# Altium project Kanaloa_v2.0.0_Power.PrjPcb
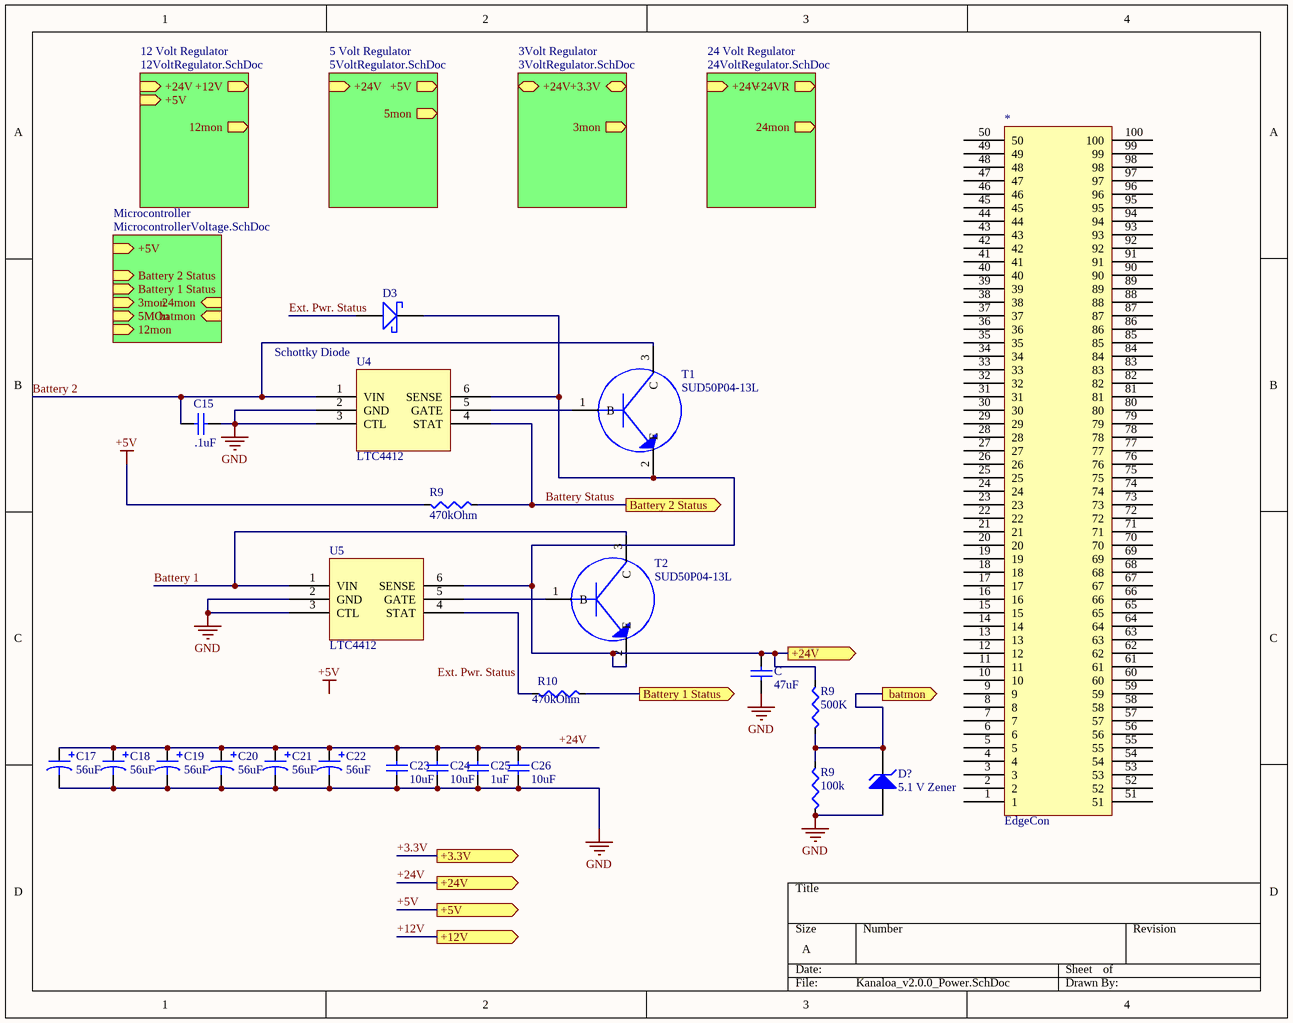
[diagram p0: Kanaloa_v2.0.0_Power.SchDoc]
6 sheets, 97 parts. Net scope: hierarchical (ports join the sheet entries above them; power ports are global).
Board file: Kanaloa_v2.0.0_Power.PcbDoc
Sheets:
  Kanaloa_v2.0.0_Power.SchDoc
    Microcontroller = MicrocontrollerVoltage.SchDoc
    5 Volt Regulator = 5VoltRegulator.SchDoc
    3Volt Regulator = 3VoltRegulator.SchDoc
    12 Volt Regulator = 12VoltRegulator.SchDoc
    24 Volt Regulator = 24VoltRegulator.SchDoc

## Sheet Kanaloa_v2.0.0_Power.SchDoc
size A

### Parts
(Parts that share a designator on the sheet are numbered #1, #2 ... from top to bottom, then left to right.)
*  EdgeCon  [5645235-3 CON]
C  47uF  [1210 (3225) Capacitor]
C15  .1uF  [0805 (2012) Capacitor]
C17  56uF  [Radial_8mmDia_SM_E]
C18  56uF  [Radial_8mmDia_SM_E]
C19  56uF  [Radial_8mmDia_SM_E]
C20  56uF  [Radial_8mmDia_SM_E]
C21  56uF  [Radial_8mmDia_SM_E]
C22  56uF  [Radial_8mmDia_SM_E]
C23  10uF  [0805 (2012) Capacitor]
C24  10uF  [0805 (2012) Capacitor]
C25  1uF  [0805 (2012) Capacitor]
C26  10uF  [0805 (2012) Capacitor]
D3  Schottky Diode  [DO-41]
D?#1  5.1 V Zener  [DIODE-0.7]
R9#1  470kOhm  [R 0805 (2012) RESISTOR]
R9#2  500K  [R 0805 (2012) RESISTOR]
R9#3  100k  [R 0805 (2012) RESISTOR]
R10  470kOhm  [R 0805 (2012) RESISTOR]
T1  SUD50P04-13L  [SOT23]
T2  SUD50P04-13L  [SOT23]
U4  LTC4412  [SOT95P245X110-6N]
U5#1  LTC4412  [SOT95P245X110-6N]

### Sub-sheets
3Volt Regulator = 3VoltRegulator.SchDoc: +24V, +3.3V, 3mon (out)
5 Volt Regulator = 5VoltRegulator.SchDoc: +24V (in), +5V (out), 5mon (out)
12 Volt Regulator = 12VoltRegulator.SchDoc: +24V (in), +12V (out), +5V (in), 12mon (out)
24 Volt Regulator = 24VoltRegulator.SchDoc: +24V (in), +24VR (out), 24mon (out)
Microcontroller = MicrocontrollerVoltage.SchDoc: +5V (in), Battery 2 Status (in), Battery 1 Status (in), 3mon (in), 5MOn (in), 12mon (in), 24mon (in), batmon (in)

### Ports
+3.3V (out), +5V (out), +12V (out), +24V (out), batmon (out), Battery 1 Status (out), Battery 2 Status (out)

### Nets
+5V: R9#1.2 ; port +5V, sheet Microcontroller/+5V
GND: C.1 C15.2 C17.N C18.N C19.N C20.N C21.N C22.N C23.2 C24.2 C25.2 C26.2 D?#1.1(A) R9#3.1 U4.2(GND) U4.3(CTL) U5#1.2(GND) U5#1.3(CTL)
+3.3V: port +3.3V
+12V: port +12V
+24V: C.2 C17.P C18.P C19.P C20.P C21.P C22.P C23.1 C24.1 C25.1 C26.1 D3.K R9#2.2 T1.2(E) T2.2(E) U4.6(SENSE) U5#1.6(SENSE) ; port +24V
Battery 1: T2.3(C) U5#1.1(VIN)
Battery 2: C15.1 T1.3(C) U4.1(VIN)
Battery Status: R9#1.1 U4.4(STAT) ; port Battery 2 Status
Ext. Pwr. Status: D3.A
NetBIG$$1_9: sheet 5 Volt Regulator/+5V, sheet 5 Volt Regulator/5mon
NetBIG$$3_9: sheet 3Volt Regulator/+3.3V, sheet 3Volt Regulator/3mon
NetD?#1_2: D?#1.2(K) R9#2.1 R9#3.2 ; port batmon
NetR10_1: R10.1 ; port Battery 1 Status
NetR10_2: R10.2 U5#1.4(STAT)
NetT1_1: T1.1(B) U4.5(GATE)
NetT2_1: T2.1(B) U5#1.5(GATE)

Not connected (* = marked no-connect by the designer): * 1 2 3 4 5 6 7 8 9 10 11 12 13 14 15 16 17 18 19 20 21 22 23 24 25 26 27 28 29 30 31 32 33 34 35 36 37 38 39 40 41 42 43 44 45 46 47 48 49 50 51 52 53 54 55 56 57 58 59 60 61 62 63 64 65 66 67 68 69 70 71 72 73 74 75 76 77 78 79 80 81 82 83 84 85 86 87 88 89 90 91 92 93 94 95 96 97 98 99 100

### Notes on the sheet
- Labels drawn without touching a wire or pin: +5V, Ext. Pwr. Status

### Library data of the parts
C C23-C26 = Capacitor (non-polarized): Capacitor; Value: .1uF
C15 = Capacitor (non-polarized): Capacitor; Value: .1uF
C17-C22 = Capacitor (polarized)
D?#1 = D Zener: Zener Diode; Published: 8-Jun-2000; LatestRevisionDate: 17-Jul-2002; LatestRevisionNote: Re-released for DXP Platform.; PackageReference: DIODE-0.7; Publisher: Altium Limited; PackageDescription: Diode, Thru-Hole; 2 Leads; 0.7 in Pin Spacing
R9#1-R9#3 R10 = Resistor: Value: 0Ohm
T1 T2 = Transistor
U4 U5#1 = LTC4412: Low Loss Power Path Controller in Thin SOT

## Sheet MicrocontrollerVoltage.SchDoc
size A
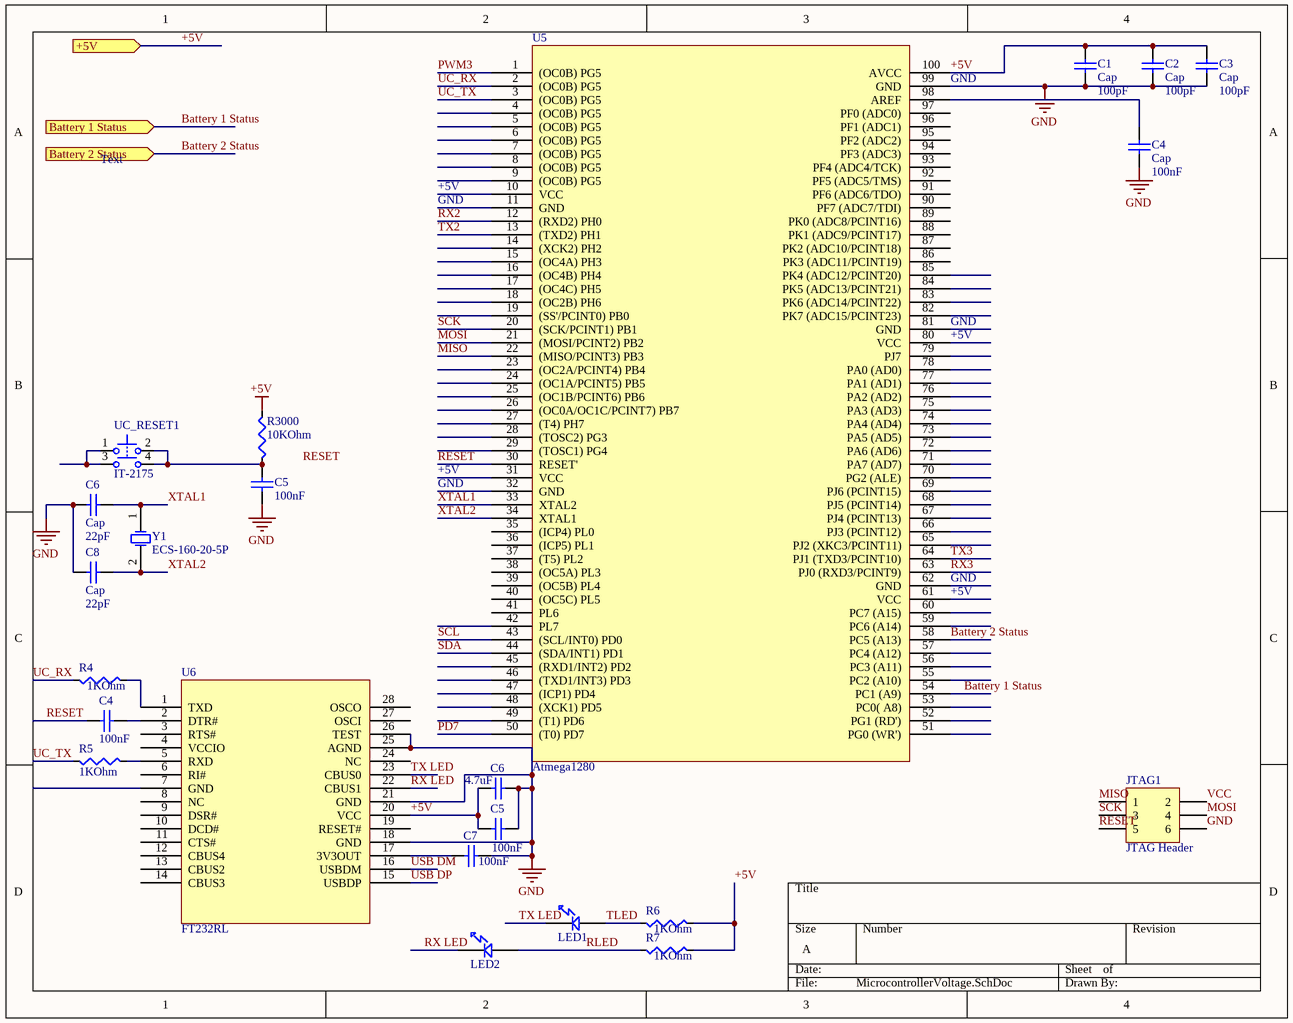
[diagram p1: MicrocontrollerVoltage.SchDoc]

### Parts
(Parts that share a designator on the sheet are numbered #1, #2 ... from top to bottom, then left to right.)
C1  Cap  value 100pF  [0805 (2012) Capacitor]
C2  Cap  value 100pF  [0805 (2012) Capacitor]
C3  Cap  value 100pF  [0805 (2012) Capacitor]
C4#1  Cap  value 100nF  [0805 (2012) Capacitor]
C4#2  100nF  [0805 (2012) Capacitor]
C5#1  100nF  [0805 (2012) Capacitor]
C5#2  100nF  [0805 (2012) Capacitor]
C6#1  Cap  value 22pF  [0805 (2012) Capacitor]
C6#2  4.7uF  [0805 (2012) Capacitor]
C7  100nF  [0805 (2012) Capacitor]
C8  Cap  value 22pF  [0805 (2012) Capacitor]
JTAG1  JTAG Header  [HDR2X3]
LED1  LED  [LED 0805]  (value not drawn)
LED2  LED  [LED 0805]  (value not drawn)
R4  1KOhm  [R 0805 (2012) RESISTOR]
R5  1KOhm  [R 0805 (2012) RESISTOR]
R6  1KOhm  [R 0805 (2012) RESISTOR]
R7  1KOhm  [R 0805 (2012) RESISTOR]
R3000  10KOhm  [R 0805 (2012) RESISTOR]
U5#2  Atmega1280  [TSQFP50P1600X1600X120-100N]
U6  FT232RL  [SOP65P780X200-28N]
UC_RESET1  IT-2175  [IT-2175]
Y1  ECS-160-20-5P  [CSM-7]

### Ports
+5V (in), Battery 1 Status (in), Battery 2 Status (in)

### Nets
+5V: C1.2 C2.2 C3.2 C5#2.1 C6#2.1 R6.2 R7.2 R3000.1 U5#2.10(VCC) U5#2.31(VCC) U5#2.61(VCC) U5#2.80(VCC) U5#2.100(AVCC) U6.20(VCC) ; port +5V
GND: C1.1 C2.1 C3.1 C4#1.1 C5#1.1 C5#2.2 C6#1.1 C6#2.2 C7.2 C8.1 JTAG1.6 U5#2.11(GND) U5#2.32(GND) U5#2.62(GND) U5#2.81(GND) U5#2.99(GND) U6.18(GND) U6.21(GND) U6.25(AGND) U6.26(TEST)
Battery 1 Status: U5#2.54(PC1_(A9)) ; port Battery 1 Status
Battery 2 Status: U5#2.58(PC5_(A13)) ; port Battery 2 Status
MISO: JTAG1.1 U5#2.22((MISO/PCINT3)_PB3)
MOSI: JTAG1.4 U5#2.21((MOSI/PCINT2)_PB2)
PD7: U5#2.50((T0)_PD7)
PWM3: U5#2.1((OC0B)_PG5)
RESET: C4#2.1 JTAG1.5 U5#2.30(RESET')
RLED: LED2.2 R7.1
RX2: U5#2.12((RXD2)_PH0)
RX3: U5#2.63(PJ0_(RXD3/PCINT9))
RX LED: LED2.1 U6.22(CBUS1)
SCK: JTAG1.3 U5#2.20((SCK/PCINT1)_PB1)
SCL: U5#2.43((SCL/INT0)_PD0)
SDA: U5#2.44((SDA/INT1)_PD1)
TLED: LED1.2 R6.1
TX2: U5#2.13((TXD2)_PH1)
TX3: U5#2.64(PJ1_(TXD3/PCINT10))
TX LED: LED1.1 U6.23(CBUS0)
UC_RX: R4.1 U5#2.2((OC0B)_PG5)
UC_TX: R5.1 U5#2.3((OC0B)_PG5)
USB DM: U6.16(USBDM)
USB DP: U6.15(USBDP)
VCC: JTAG1.2
XTAL1: C6#1.2 U5#2.33(XTAL2) Y1.1(OSC1)
XTAL2: C8.2 U5#2.34(XTAL1) Y1.2(OSC2)
NetC4#1_2: C4#1.2 U5#2.98(AREF)
NetC4#2_2: C4#2.2 U6.2(DTR#)
NetC5#1_2: C5#1.2 R3000.2 UC_RESET1.2 UC_RESET1.4
NetC7_1: C7.1 U6.17(3V3OUT)
NetR4_2: R4.2 U6.1(TXD)
NetR5_2: R5.2 U6.5(RXD)
NetUC_RESET1_1: UC_RESET1.1 UC_RESET1.3

Not connected (* = marked no-connect by the designer): U5#2 4((OC0B)_PG5) 5((OC0B)_PG5) 6((OC0B)_PG5) 7((OC0B)_PG5) 8((OC0B)_PG5) 9((OC0B)_PG5) 14((XCK2)_PH2) 15((OC4A)_PH3) 16((OC4B)_PH4) 17((OC4C)_PH5) 18((OC2B)_PH6) 19((SS'/PCINT0)_PB0) 23((OC2A/PCINT4)_PB4) 24((OC1A/PCINT5)_PB5) 25((OC1B/PCINT6)_PB6) 26((OC0A/OC1C/PCINT7)_PB7) 27((T4)_PH7) 28((TOSC2)_PG3) 29((TOSC1)_PG4) 35((ICP4)_PL0) 36((ICP5)_PL1) 37((T5)_PL2) 38((OC5A)_PL3) 39((OC5B)_PL4) 40((OC5C)_PL5) 41(PL6) 42(PL7) 45((RXD1/INT2)_PD2) 46((TXD1/INT3)_PD3) 47((ICP1)_PD4) 48((XCK1)_PD5) 49((T1)_PD6) 51(PG0_(WR')) 52(PG1_(RD')) 53(PC0(_A8)) 55(PC2_(A10)) 56(PC3_(A11)) 57(PC4_(A12)) 59(PC6_(A14)) 60(PC7_(A15)) 65(PJ2_(XKC3/PCINT11)) 66(PJ3_(PCINT12)) 67(PJ4_(PCINT13)) 68(PJ5_(PCINT14)) 69(PJ6_(PCINT15)) 70(PG2_(ALE)) 71(PA7_(AD7)) 72(PA6_(AD6)) 73(PA5_(AD5)) 74(PA4_(AD4)) 75(PA3_(AD3)) 76(PA2_(AD2)) 77(PA1_(AD1)) 78(PA0_(AD0)) 79(PJ7) 82(PK7_(ADC15/PCINT23)) 83(PK6_(ADC14/PCINT22)) 84(PK5_(ADC13/PCINT21)) 85(PK4_(ADC12/PCINT20)) 86(PK3_(ADC11/PCINT19)) 87(PK2_(ADC10/PCINT18)) 88(PK1_(ADC9/PCINT17)) 89(PK0_(ADC8/PCINT16)) 90(PF7_(ADC7/TDI)) 91(PF6_(ADC6/TDO)) 92(PF5_(ADC5/TMS)) 93(PF4_(ADC4/TCK)) 94(PF3_(ADC3)) 95(PF2_(ADC2)) 96(PF1_(ADC1)) 97(PF0_(ADC0)); U6 3(RTS#) 4(VCCIO) 6(RI#) 7(GND) 8(NC) 9(DSR#) 10(DCD#) 11(CTS#) 12(CBUS4) 13(CBUS2) 14(CBUS3) 19(RESET#) 24(NC) 27(OSCI) 28(OSCO)

### Notes on the sheet
- Text
- Labels drawn without touching a wire or pin: RESET

### Library data of the parts
C1-C3 C4#1 C6#1 C8 = Cap: Capacitor; Published: 8-Jun-2000; LatestRevisionDate: 17-Jul-2002; LatestRevisionNote: Re-released for DXP Platform.; PackageReference: RAD-0.3; Publisher: Altium Limited
C4#2 C5#1 C5#2 C6#2 C7 = Capacitor (non-polarized): Capacitor; Value: .1uF
JTAG1 = Header 3X2: Header, 3-Pin, Dual row; LatestRevisionDate: 17-Jul-2002; LatestRevisionNote: Re-released for DXP Platform.; Publisher: Altium Limited
LED1 LED2 = LED: Standard LED
R4-R7 R3000 = Resistor: Value: 0Ohm
UC_RESET1 = IT-2175: Tactile Switch, DPST; Thru-Hole; Vertical; Rating DC 12V, 50mA (max); PackageDocument: Rev.0; Published: 6-Jun-2005; DatasheetDocument: Rev.0; PackageReference: IT-2175; Publisher: Altium Limited; ComponentLink1Description: Manufacturer Link; ComponentLink1URL: http://www.ilswitch.com/; ComponentLink2Description: Device Overview; ComponentLink2URL: http://www.ilswitch.com/list.php?ac_id=010112&ai_id=91
Y1 = ECS-120-32-1: Crystal Oscillator; Published: 17-Jul-2002; DatasheetDocument: 18-Apr-2000; PackageReference: HC-49U; Publisher: Altium Limited; ComponentLink1Description: Manufacturer Link; ComponentLink1URL: http://www.ecsxtal.com/; ComponentLink2Description: Datasheet; ComponentLink2URL: http://www.ecsxtal.com/pdf2/HC49U.PDF

## Sheet 5VoltRegulator.SchDoc
size A
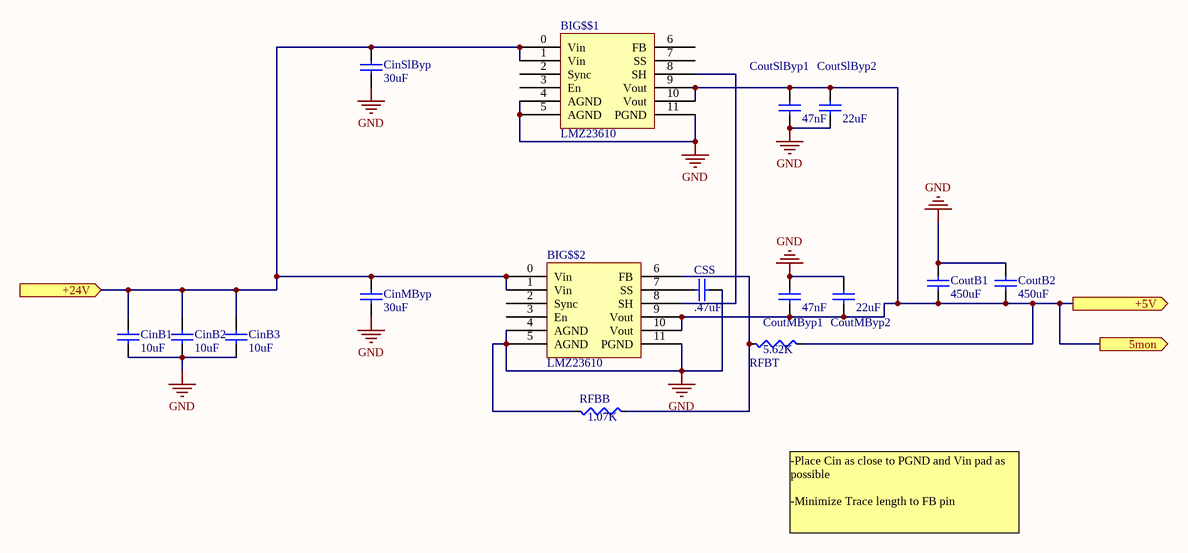
[diagram p2: 5VoltRegulator.SchDoc]

### Parts
(Parts that share a designator on the sheet are numbered #1, #2 ... from top to bottom, then left to right.)
BIG$$1  LMZ23610  [LMZ23610]
BIG$$2  LMZ23610  [LMZ23610]
CinB1  10uF  [0805 (2012) Capacitor]
CinB2  10uF  [0805 (2012) Capacitor]
CinB3  10uF  [0805 (2012) Capacitor]
CinMByp  30uF  [0805 (2012) Capacitor]
CinSlByp  30uF  [0805 (2012) Capacitor]
CoutB1  450uF  [0805 (2012) Capacitor]
CoutB2  450uF  [0805 (2012) Capacitor]
CoutMByp1  47nF  [0805 (2012) Capacitor]
CoutMByp2  22uF  [0805 (2012) Capacitor]
CoutSlByp1  47nF  [0805 (2012) Capacitor]
CoutSlByp2  22uF  [0805 (2012) Capacitor]
CSS#1  .47uF  [0805 (2012) Capacitor]
RFBB#1  1.07K  [R 0805 (2012) RESISTOR]
RFBT#1  5.62K  [R 0805 (2012) RESISTOR]

### Ports
5mon (out), +5V (out), +24V (in)

### Nets
GND: BIG$$1.4(AGND) BIG$$1.5(AGND) BIG$$1.11(PGND) BIG$$2.4(AGND) BIG$$2.5(AGND) BIG$$2.11(PGND) CinB1.1 CinB2.1 CinB3.1 CinMByp.1 CinSlByp.1 CoutB1.2 CoutB2.2 CoutMByp1.2 CoutMByp2.2 CoutSlByp1.1 CoutSlByp2.1 CSS#1.2 RFBB#1.1
NetBIG$$1_0: BIG$$1.0(Vin) BIG$$1.1(Vin) BIG$$2.0(Vin) BIG$$2.1(Vin) CinB1.2 CinB2.2 CinB3.2 CinMByp.2 CinSlByp.2 ; port +24V
NetBIG$$1_8: BIG$$1.8(SH) BIG$$2.8(SH)
NetBIG$$1_9: BIG$$1.9(Vout) BIG$$1.10(Vout) BIG$$2.9(Vout) BIG$$2.10(Vout) CoutB1.1 CoutB2.1 CoutMByp1.1 CoutMByp2.1 CoutSlByp1.2 CoutSlByp2.2 RFBT#1.2 ; port +5V, port 5mon
NetBIG$$2_6: BIG$$2.6(FB) RFBB#1.2 RFBT#1.1
NetBIG$$2_7: BIG$$2.7(SS) CSS#1.1

Not connected (* = marked no-connect by the designer): BIG$$1 2(Sync) 3(En) 6(FB) 7(SS); BIG$$2 2(Sync) 3(En)

### Notes on the sheet
- -Place Cin as close to PGND and Vin pad as possible
  -Minimize Trace length to FB pin

### Library data of the parts
CinB1-CinB3 CinMByp CinSlByp CoutB1 CoutB2 CoutMByp1 CoutMByp2 CoutSlByp1 CoutSlByp2 CSS#1 = Capacitor (non-polarized): Capacitor; Value: .1uF
RFBB#1 RFBT#1 = Resistor: Value: 0Ohm

## Sheet 3VoltRegulator.SchDoc
size A
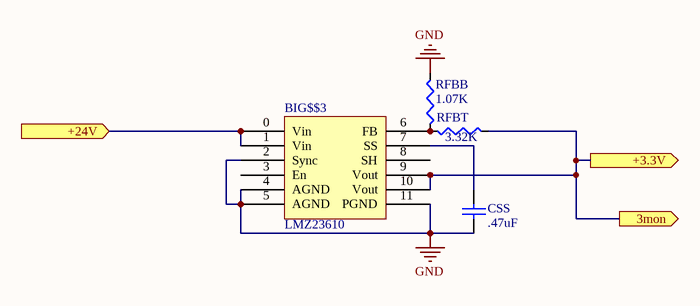
[diagram p3: 3VoltRegulator.SchDoc]

### Parts
(Parts that share a designator on the sheet are numbered #1, #2 ... from top to bottom, then left to right.)
BIG$$3  LMZ23610  [LMZ23610]
CSS#2  .47uF  [0805 (2012) Capacitor]
RFBB#2  1.07K  [R 0805 (2012) RESISTOR]
RFBT#2  3.32K  [R 0805 (2012) RESISTOR]

### Ports
3mon (out), +3.3V (out), +24V (in)

### Nets
GND: BIG$$3.2(Sync) BIG$$3.4(AGND) BIG$$3.5(AGND) BIG$$3.11(PGND) CSS#2.1 RFBB#2.2
NetBIG$$3_0: BIG$$3.0(Vin) BIG$$3.1(Vin) ; port +24V
NetBIG$$3_6: BIG$$3.6(FB) RFBB#2.1 RFBT#2.1
NetBIG$$3_7: BIG$$3.7(SS) CSS#2.2
NetBIG$$3_9: BIG$$3.9(Vout) BIG$$3.10(Vout) RFBT#2.2 ; port +3.3V, port 3mon

Not connected (* = marked no-connect by the designer): BIG$$3 3(En) 8(SH)

### Library data of the parts
CSS#2 = Capacitor (non-polarized): Capacitor; Value: .1uF
RFBB#2 RFBT#2 = Resistor: Value: 0Ohm

## Sheet 12VoltRegulator.SchDoc
size A
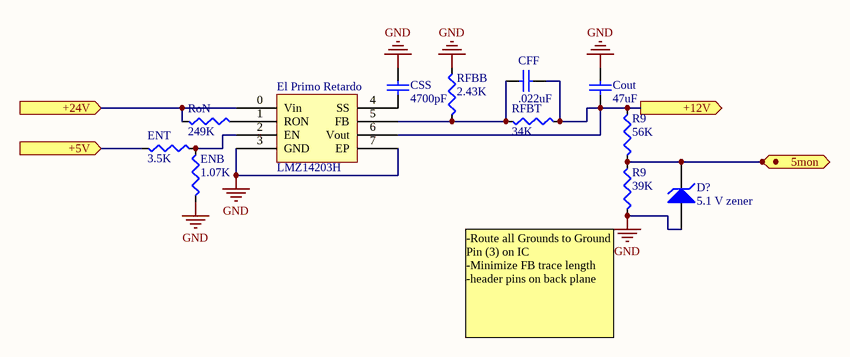
[diagram p4: 12VoltRegulator.SchDoc]

### Parts
(Parts that share a designator on the sheet are numbered #1, #2 ... from top to bottom, then left to right.)
CFF#1  .022uF  [0805 (2012) Capacitor]
Cout  47uF  [0805 (2012) Capacitor]
CSS#3  4700pF  [0805 (2012) Capacitor]
D?#2  5.1 V zener  [DIODE-0.7]
El_Primo_Retardo  LMZ14203H  [LMZ14203H]
ENB  1.07K  [R 0805 (2012) RESISTOR]
ENT  3.5K  [R 0805 (2012) RESISTOR]
R9#4  56K  [R 0805 (2012) RESISTOR]
R9#5  39K  [R 0805 (2012) RESISTOR]
RFBB#3  2.43K  [R 0805 (2012) RESISTOR]
RFBT#3  34K  [R 0805 (2012) RESISTOR]
RoN  249K  [R 0805 (2012) RESISTOR]

### Ports
5mon (out), +5V (in), +12V (out), +24V (in)

### Nets
GND: Cout.2 CSS#3.2 D?#2.1(A) El_Primo_Retardo.3(GND) El_Primo_Retardo.7(EP) ENB.1 R9#5.1 RFBB#3.2
NetCFF#1_1: CFF#1.1 Cout.1 El_Primo_Retardo.6(Vout) R9#4.1 RFBT#3.1 ; port +12V
NetCFF#1_2: CFF#1.2 El_Primo_Retardo.5(FB) RFBB#3.1 RFBT#3.2
NetCSS#3_1: CSS#3.1 El_Primo_Retardo.4(SS)
NetD?#2_2: D?#2.2(K) R9#4.2 R9#5.2 ; port 5mon
NetEl_Primo_Retardo_0: El_Primo_Retardo.0(Vin) RoN.2 ; port +24V
NetEl_Primo_Retardo_1: El_Primo_Retardo.1(RON) RoN.1
NetEl_Primo_Retardo_2: El_Primo_Retardo.2(EN) ENB.2 ENT.1
NetENT_2: ENT.2 ; port +5V

### Notes on the sheet
- (near R9#5) -Route all Grounds to Ground Pin (3) on IC
  -Minimize FB trace length
  -header pins on back plane

### Library data of the parts
CFF#1 Cout CSS#3 = Capacitor (non-polarized): Capacitor; Value: .1uF
D?#2 = D Zener: Zener Diode; Published: 8-Jun-2000; LatestRevisionDate: 17-Jul-2002; LatestRevisionNote: Re-released for DXP Platform.; PackageReference: DIODE-0.7; Publisher: Altium Limited; PackageDescription: Diode, Thru-Hole; 2 Leads; 0.7 in Pin Spacing
El_Primo_Retardo = LMZ14203
ENB ENT R9#4 R9#5 RFBB#3 RFBT#3 RoN = Resistor: Value: 0Ohm

## Sheet 24VoltRegulator.SchDoc
size A
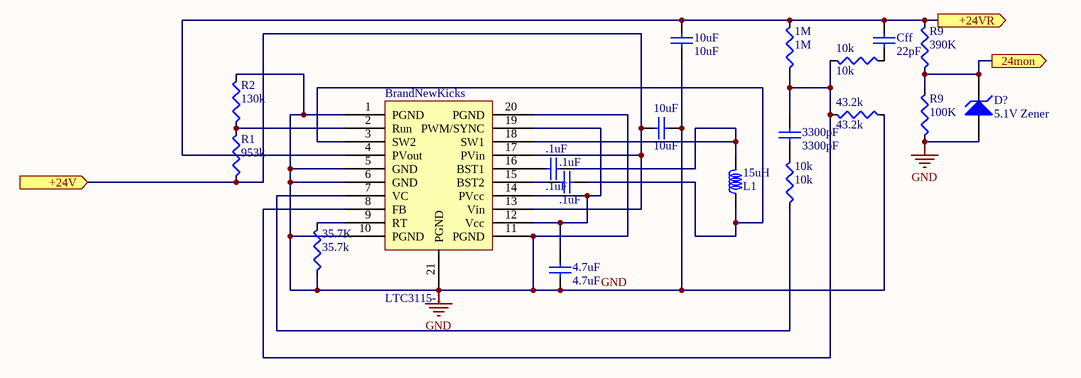
[diagram p5: 24VoltRegulator.SchDoc]

### Parts
(Parts that share a designator on the sheet are numbered #1, #2 ... from top to bottom, then left to right.)
1M  1M  [R 0805 (2012) RESISTOR]
4.7uF  4.7uF  [0805 (2012) Capacitor]
10k#1  10k  [R 0805 (2012) RESISTOR]
10k#2  10k  [R 0805 (2012) RESISTOR]
10uF#1  10uF  [0805 (2012) Capacitor]
10uF#2  10uF  [0805 (2012) Capacitor]
15uH  L1  [WurstInductor]
35.7K  35.7k  [R 0805 (2012) RESISTOR]
43.2k  43.2k  [R 0805 (2012) RESISTOR]
3300pF  3300pF  [0805 (2012) Capacitor]
.1uF#1  .1uF  [0402 (1005) CAPACITOR]
.1uF#2  .1uF  [0402 (1005) CAPACITOR]
BrandNewKicks  LTC3115-1  [LTC3115-1]
Cff#2  22pF  [0805 (2012) Capacitor]
D?#3  5.1V Zener  [DIODE-0.7]
R1  953k  [R 0805 (2012) RESISTOR]
R2  130k  [R 0805 (2012) RESISTOR]
R9#6  390K  [R 0805 (2012) RESISTOR]
R9#7  100K  [R 0805 (2012) RESISTOR]

### Ports
24mon (out), +24V (in), +24VR (out)

### Nets
GND: 4.7uF.2 10uF#1.2 10uF#2.1 35.7K.1 43.2k.1 BrandNewKicks.1(PGND) BrandNewKicks.5(GND) BrandNewKicks.6(GND) BrandNewKicks.10(PGND) BrandNewKicks.11(PGND) BrandNewKicks.20(PGND) BrandNewKicks.21(PGND) D?#3.1(A) R2.2 R9#7.1
Net1M_1: 1M.1 10k#1.2 43.2k.2 3300pF.1 BrandNewKicks.8(FB)
Net1M_2: 1M.2 10uF#1.1 BrandNewKicks.4(PVout) Cff#2.1 R9#6.1 ; port +24VR
Net4.7uF_1: 4.7uF.1 BrandNewKicks.12(Vcc) BrandNewKicks.14(PVcc) BrandNewKicks.19(PWM/SYNC)
Net10k#1_1: 10k#1.1 Cff#2.2
Net10k#2_1: 10k#2.1 BrandNewKicks.7(VC)
Net10k#2_2: 10k#2.2 3300pF.2
Net10uF#2_2: 10uF#2.2 BrandNewKicks.13(Vin) BrandNewKicks.17(PVin) R1.1 ; port +24V
Net15uH_1: 15uH.1 .1uF#2.1 BrandNewKicks.3(SW2)
Net15uH_2: 15uH.2 .1uF#1.1 BrandNewKicks.18(SW1)
Net35.7K_2: 35.7K.2 BrandNewKicks.9(RT)
Net.1uF#1_2: .1uF#1.2 BrandNewKicks.16(BST1)
Net.1uF#2_2: .1uF#2.2 BrandNewKicks.15(BST2)
NetBrandNewKicks_2: BrandNewKicks.2(Run) R1.2 R2.1
NetD?#3_2: D?#3.2(K) R9#6.2 R9#7.2 ; port 24mon

### Library data of the parts
1M 10k#1 10k#2 35.7K 43.2k R1 R2 R9#6 R9#7 = Resistor: Value: 0Ohm
4.7uF 10uF#1 10uF#2 3300pF Cff#2 = Capacitor (non-polarized): Capacitor; Value: .1uF
15uH = Inductor
.1uF#1 .1uF#2 = Capacitor (non-polarized): Capacitor; Value: .1uF
D?#3 = D Zener: Zener Diode; Published: 8-Jun-2000; LatestRevisionDate: 17-Jul-2002; LatestRevisionNote: Re-released for DXP Platform.; PackageReference: DIODE-0.7; Publisher: Altium Limited; PackageDescription: Diode, Thru-Hole; 2 Leads; 0.7 in Pin Spacing

## Nets that join several sheets
+5V: Kanaloa_v2.0.0_Power (R9#1.2), MicrocontrollerVoltage (14 pins)
GND: Kanaloa_v2.0.0_Power (18 pins), MicrocontrollerVoltage (20 pins), 5VoltRegulator (19 pins), 3VoltRegulator (6 pins), 12VoltRegulator (8 pins), 24VoltRegulator (15 pins)